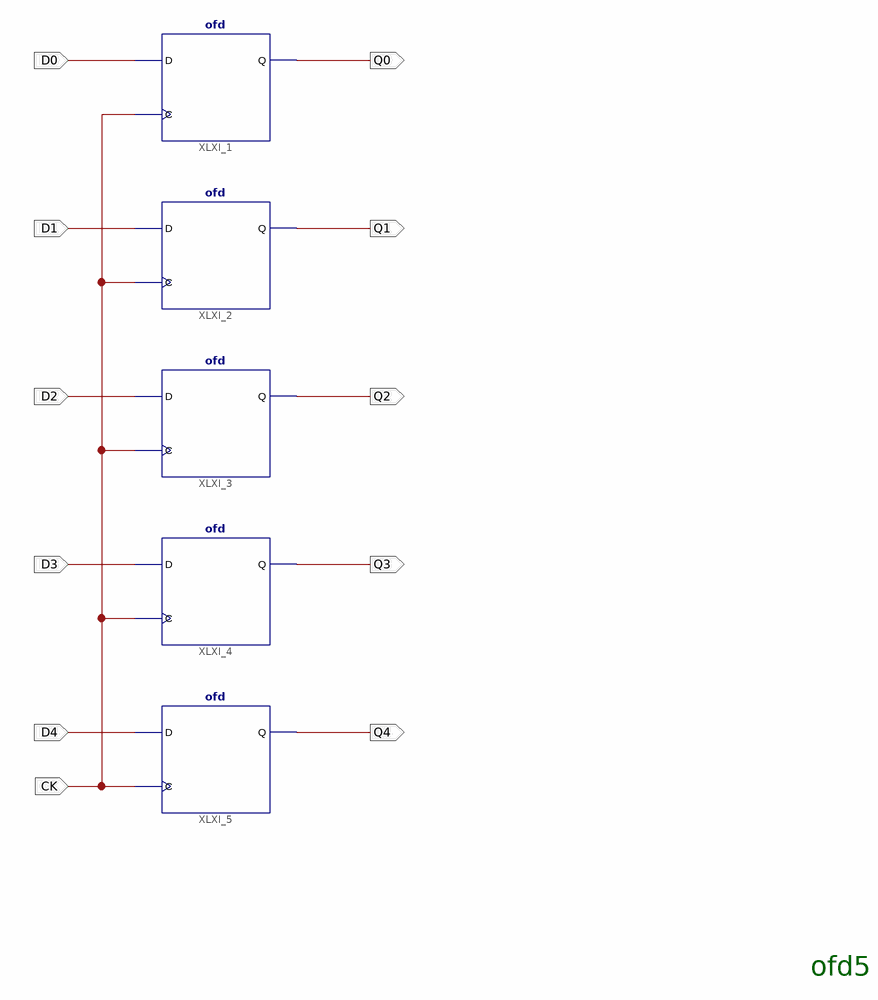
[diagram p0: schematic sheet 1]
// Xilinx ISE schematic ofd5.sch (spartan6) as structural Verilog: 5 symbols, 11 ports
module ofd5 (
  input  D0,
  input  D1,
  input  D2,
  input  CK,
  input  D3,
  input  D4,
  output Q2,
  output Q1,
  output Q0,
  output Q3,
  output Q4
);

  ofd XLXI_1 (.C(CK), .D(D0), .Q(Q0));
  ofd XLXI_2 (.C(CK), .D(D1), .Q(Q1));
  ofd XLXI_3 (.C(CK), .D(D2), .Q(Q2));
  ofd XLXI_4 (.C(CK), .D(D3), .Q(Q3));
  ofd XLXI_5 (.C(CK), .D(D4), .Q(Q4));

  // Notes on the sheet:
  //   ofd5
endmodule
